# EAGLE design Mind-Synchronizing-Generator-Bak (EAGLE 7.2.0)
Analoger Wellenmustergenerator mit 3 (trippel-Fünf) 555 Timer.
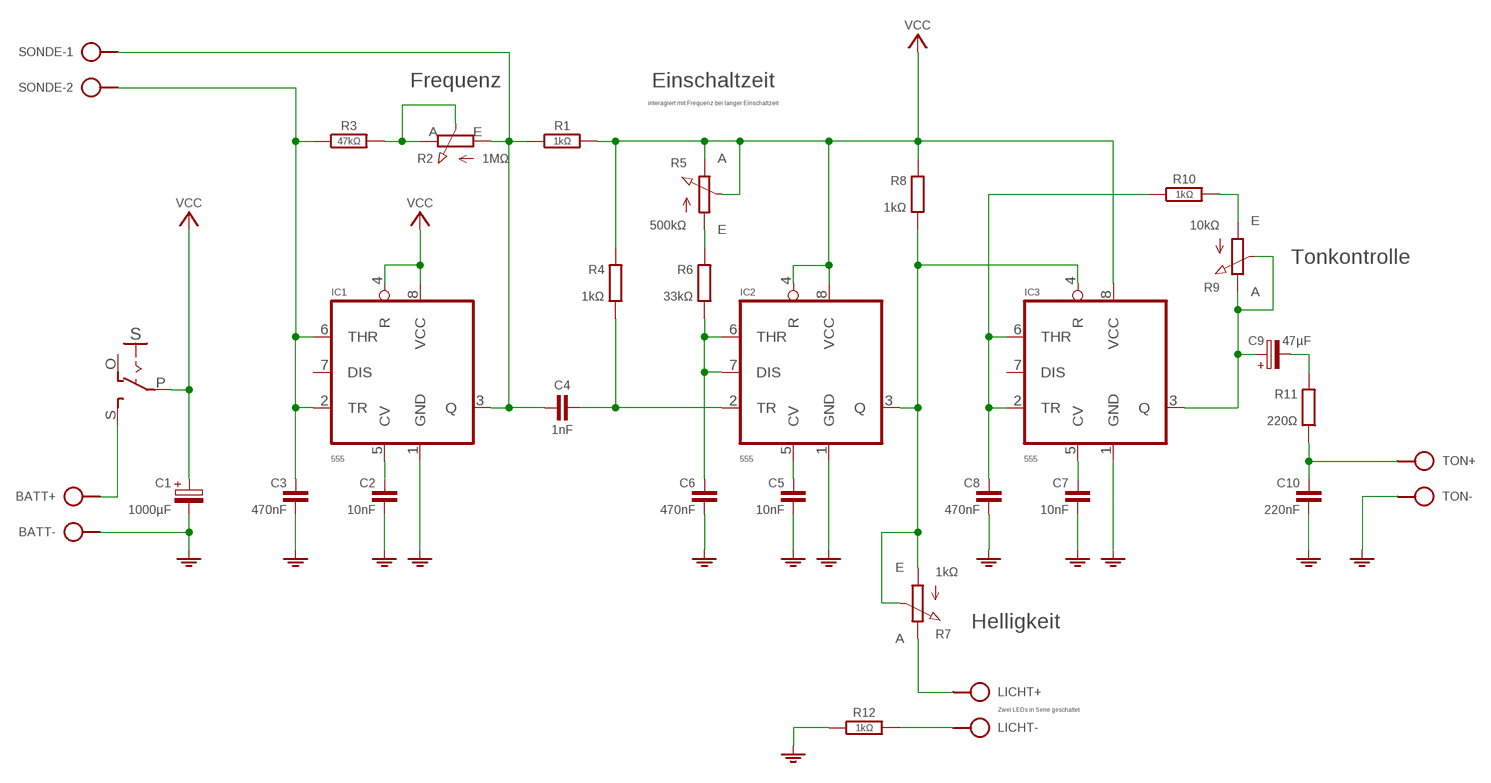
[diagram p0: schematic, sheet 1]

## Parts
BATT  SPAD+--+  [SPAD-+]
C1  1000µF  CPOLE2.5-6  [E2,5-6]
C2  10nF  C050-020X044  [C050-020X044]
C3  470nF  C050-040X075  [C050-040X075]
C4  1nF  C-H050-020X044  [C050-020X044]
C5  10nF  C050-020X044/V  [C050-020X044/V]
C6  470nF  C050-040X075  [C050-040X075]
C7  10nF  C075-020X044  [C075-020X044]
C8  470nF  C050-040X075  [C050-040X075]
C9  47µF  CPOL-HE2,5-4  [E2,5-4]
C10  220nF  C025-025X060  [C050-025X060]
IC1  555  555_ALT2-LBL  [555-DIL]
IC2  555  555_ALT2-LBL  [555-DIL]
IC3  555  555_ALT2-LBL  [555-DIL]
LICHT  SPAD+--+  [SPAD-+]
R1  1kΩ  R-H0204/10  [0204/10]
R2  1MΩ  POT-H-3P  [CONN-3P]
R3  47kΩ  R-H0204/10  [0204/10]
R4  1kΩ  R0204/10-V  [0204/10-V]
R5  500kΩ  POT-45X40  [POT-45X40]
R6  33kΩ  R0204/10  [0204/10]
R7  1kΩ  POT-3P  [CONN-3P]
R8  1kΩ  R0204/10-V  [0204/10-V]
R9  10kΩ  POT-45X40  [POT-45X40]
R10  1kΩ  R-H0204/10  [0204/10]
R11  220Ω  R0204/10-V  [0204/10-V]
R12  1kΩ  R-H0204/10  [0204/10]
S  SL-SW-1P-2T  [SLSW-1P2T]
SONDE  SPAD-2  [SPAD-2]
TON  SPAD+-+-  [SPAD+-]

## Nets
GND: BATT.1 C1.- C2.2 C3.2 C5.2 C6.2 C7.2 C8.2 C10.2 IC1.1(GND) IC2.1(GND) IC3.1(GND) R12.1 TON.1
N$1: C5.1 IC2.5(CV)
N$2: BATT.2 S.S
N$3: R2.2(S) R2.3(E) R3.2
N$4: LICHT.2 R7.3(E)
N$5: C4.2 IC2.2(TR) R4.2
N$6: C3.1 IC1.2(TR) IC1.6(THR) R3.1 SONDE.2
N$7: C2.1 IC1.5(CV)
N$8: R5.A R6.1
N$9: C6.1 IC2.6(THR) IC2.7(DIS) R6.2
N$10: R9.A R10.2
N$12: C8.1 IC3.2(TR) IC3.6(THR) R10.1
N$15: C9.- R11.1
N$16: C10.1 R11.2 TON.2
N$17: C7.1 IC3.5(CV)
N$18: LICHT.1 R12.2
Q1: C4.1 IC1.3(Q) R1.1 R2.1(A) SONDE.1
Q2: IC2.3(Q) IC3.4(R) R7.1(A) R7.2(S) R8.2
Q3: C9.+ IC3.3(Q) R9.E R9.S
VCC: C1.+ IC1.4(R) IC1.8(VCC) IC2.4(R) IC2.8(VCC) IC3.8(VCC) R1.2 R4.1 R5.E R5.S R8.1 S.P
Unconnected: IC1.7(DIS) IC3.7(DIS) S.O

## Notes on the sheet
- Frequenz | Einschaltzeit
- interagiert mit Frequenz bei langer Einschaltzeit
- Tonkontrolle
- Helligkeit
- Zwei LEDs in Serie geschaltet

## Library data of the parts
BATT LICHT TON = pad:SPAD+-
C1 = c:CPOL: POLARIZED CAPACITOR, European symbol
C2 C3 C5-C8 C10 = c:C: CAPACITOR, European symbol
C4 = c:C-H
C9 = c:CPOL-H
IC1-IC3 = ic:*555_ALT2
R1 R3 R10 R12 = r:R-H
R2 = r:POT-H
R4 R6 R8 R11 = r:R: RESISTOR, European symbol
R5 R7 R9 = r:POT
S = sw:SL-SW-1P-2T
SONDE = pad:SPAD-2

## Board
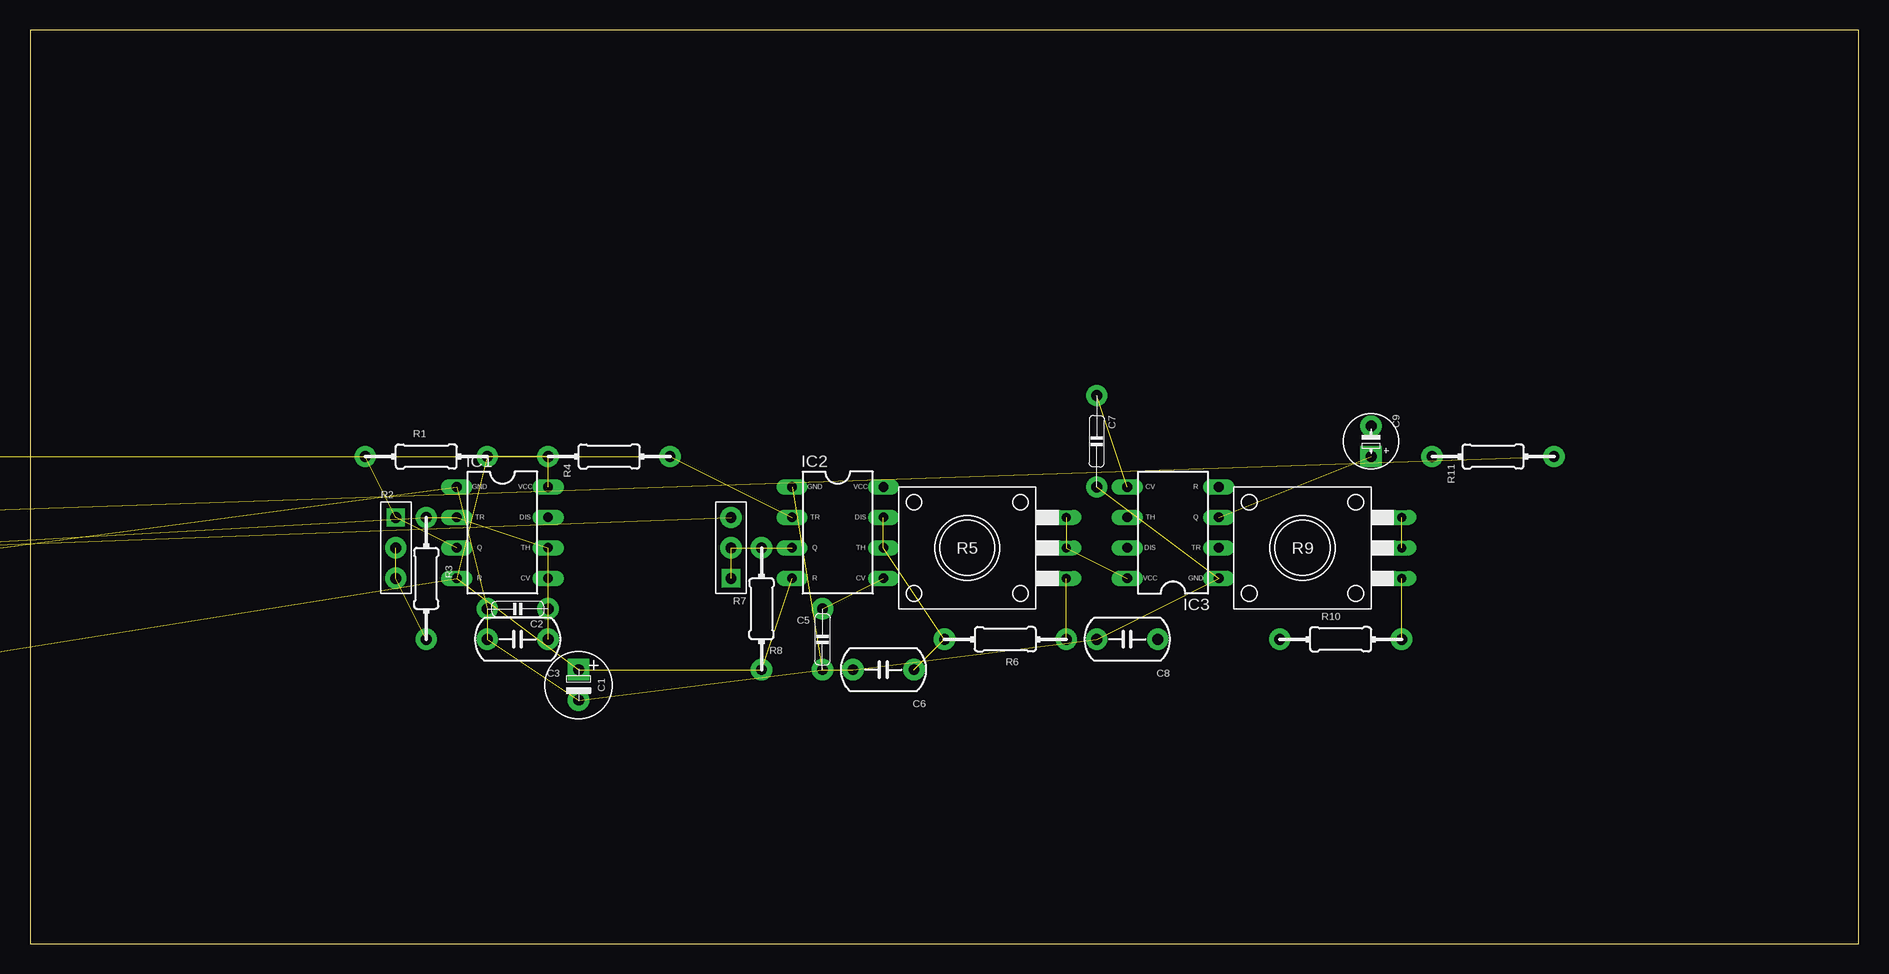
[diagram p1: board, top side]
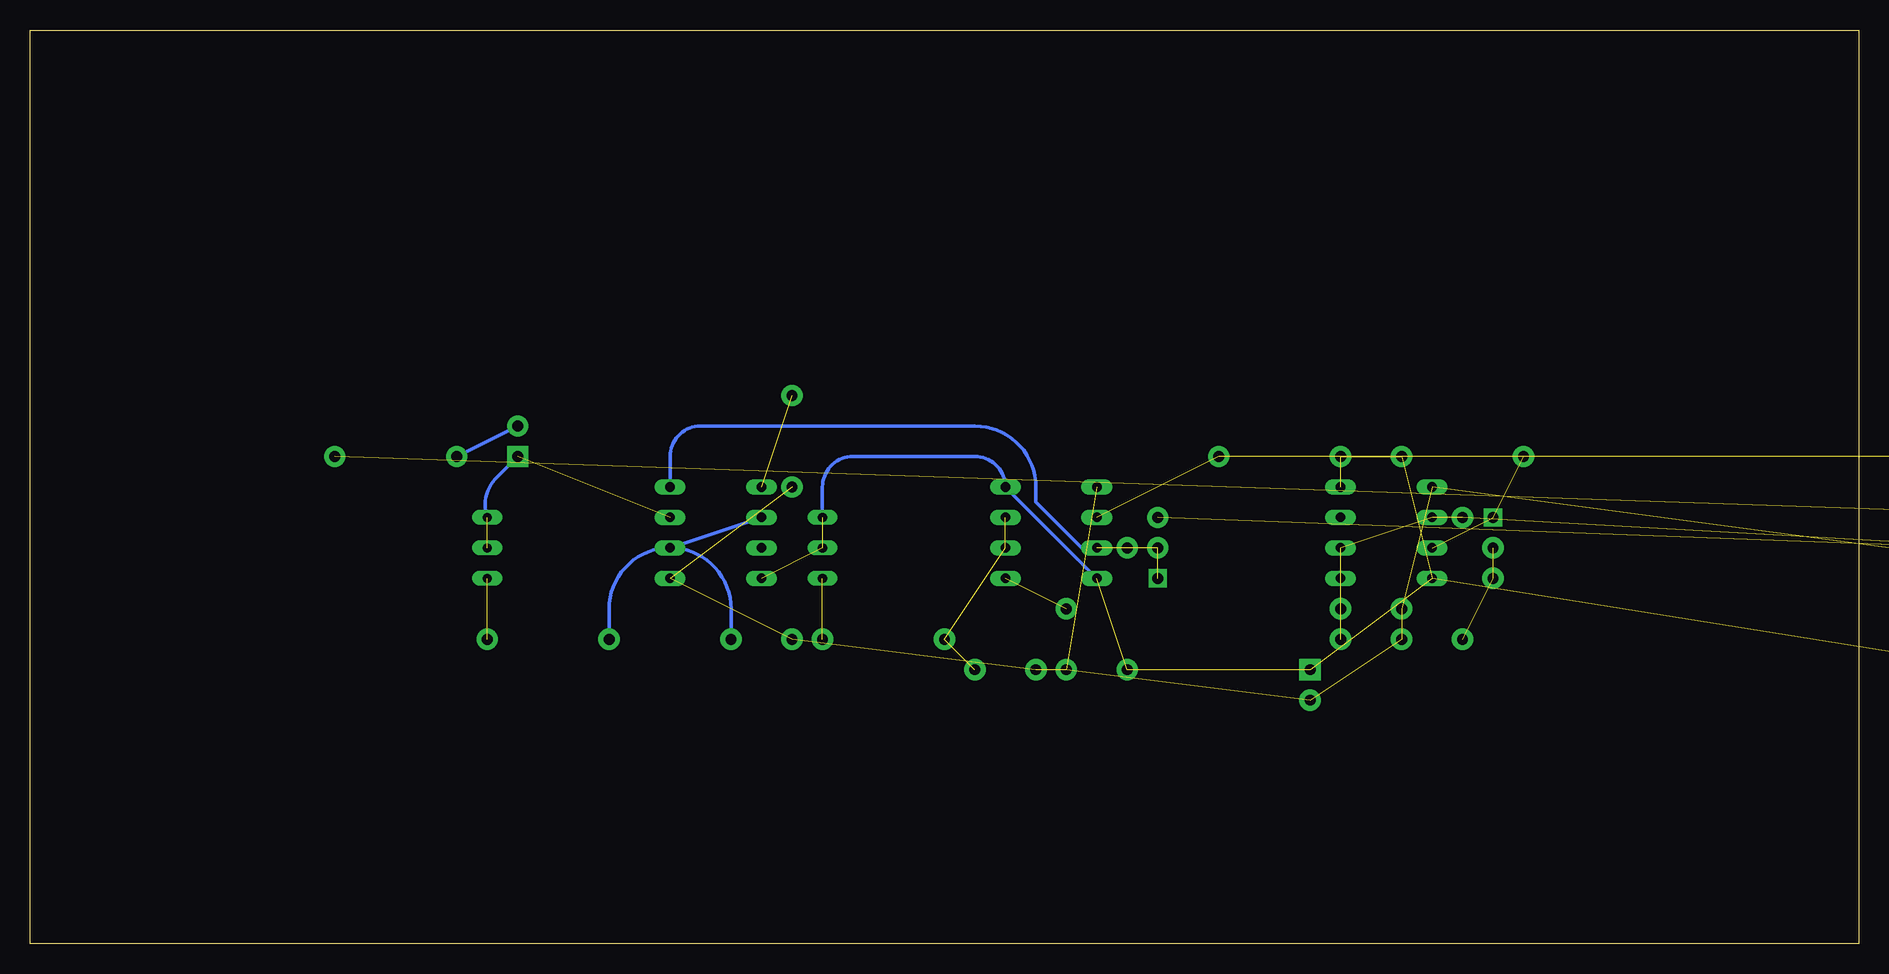
[diagram p2: board, bottom side, seen from below]

Size 152.4 x 76.2 mm. Coordinates in mm from the lower left corner, seen from the top.
Outline: 0,0 152.4,0 152.4,76.2 0,76.2 0,0
Copper layers (1*16): Top 0.035mm / dielectric 1.5mm / Bottom 0.035mm
Design rules "default": minimum track width 10mil, minimum drill 24mil, track to track 8mil, track to pad 8mil, pad to pad 8mil, via to via 8mil, smd to smd 8mil, copper to edge 40mil, drill to drill 8mil, minimum pad ring 10mil, minimum via ring 8mil, stop-mask expansion 4mil, vias tented up to drill 0mil, thermal gap 10mil

### Footprints (pad centres in the part's own frame; a part is rotated, then mirrored left to right if it is on the bottom)
SPAD-+ = drill 0.9 pad 1.524 square: 1 0,-1.27 | drill 0.9 pad 1.778: 2 0,1.27
E2,5-6 = drill 0.9 pad 1.778 square: + -1.27,0 | drill 0.9 pad 1.778: - 1.27,0
C050-020X044 = drill 0.9 pad 1.778: 1 -2.54,0; 2 2.54,0
C050-040X075 = drill 0.9 pad 1.778: 1 -2.54,0; 2 2.54,0
C050-020X044/V = drill 0.9 pad 1.778: 1 0,2.54; 2 0,-2.54
C075-020X044 = drill 0.9 pad 1.778: 1 -2.54,0; 2 5.08,0
E2,5-4 = drill 0.9 pad 1.778 square: + 1.27,0 | drill 0.9 pad 1.778: - -1.27,0
C050-025X060 = drill 0.9 pad 1.778: 1 0,2.54; 2 0,-2.54
555-DIL = drill 0.8 pad 1.27 long: 1 -3.81,3.81; 2 -3.81,1.27; 3 -3.81,-1.27; 4 -3.81,-3.81; 5 3.81,-3.81; 6 3.81,-1.27; 7 3.81,1.27; 8 3.81,3.81
0204/10 = drill 0.9 pad 1.778: 1 -5.08,0; 2 5.08,0
CONN-3P = drill 0.9 pad 1.524 square: 1 0,2.54 | drill 0.9 pad 1.778: 2 0,0; 3 0,-2.54
0204/10-V = drill 0.9 pad 1.778: 1 0,5.08; 2 0,-5.08
POT-45X40 = drill 0.762 long: A 0,-2.54; E 0,2.54; S 0,0
SLSW-1P2T = drill 1.1 pad 1.778 octagon: O 0,2.54; P 0,0; S 0,-2.54
SPAD-2 = drill 0.9 pad 1.778: 1 0,-1.27; 2 0,1.27
SPAD+- = drill 0.9 pad 1.524 square: 1 0,-1.27 | drill 0.9 pad 1.778: 2 0,1.27

### Placement (x,y rotation side)
BATT  -39.37,30.48 0 top  (outside the outline)
C1  45.72,21.59 270 top
C2  40.64,27.94 180 top
C3  40.64,25.4 180 top
C4  -21.59,40.64 0 top  (outside the outline)
C5  66.04,25.4 0 top
C6  71.12,22.86 180 top
C7  88.9,43.18 270 top
C8  91.44,25.4 180 top
C9  111.76,41.91 270 top
C10  -21.59,33.02 0 top  (outside the outline)
IC1  39.37,34.29 0 top
IC2  67.31,34.29 0 top
IC3  95.25,34.29 180 top
LICHT  -43.18,30.48 0 top  (outside the outline)
R1  33.02,40.64 0 top
R2  30.48,33.02 0 top
R3  33.02,30.48 270 top
R4  48.26,40.64 90 top
R5  86.36,33.02 0 top
R6  81.28,25.4 180 top
R7  58.42,33.02 180 top
R8  60.96,27.94 180 top
R9  114.3,33.02 0 top
R10  109.22,25.4 0 top
R11  121.92,40.64 90 top
R12  -19.05,48.26 0 top  (outside the outline)
S  -27.94,20.32 0 top  (outside the outline)
SONDE  -34.29,30.48 0 top  (outside the outline)
TON  -48.26,30.48 0 top  (outside the outline)

### Tracks (layer width: path | path; a pad name or v marks a point on that pad's centre or on a via)
GND  (13 unrouted)
N$1  (1 unrouted)
N$2  (1 unrouted)
N$3  (2 unrouted)
N$4  (1 unrouted)
N$5  (2 unrouted)
N$6  (4 unrouted)
N$7  (1 unrouted)
N$8  (1 unrouted)
N$9  (3 unrouted)
N$10  (1 unrouted)
N$12
  Bottom 0.305: R10.1 104.14,27.94 arc90 IC3.2 | IC3.2 IC3.6 | IC3.2 arc90 93.98,27.94 C8.1
N$15
  Bottom 0.305: R11.1 C9.-
N$16  (2 unrouted)
N$17  (1 unrouted)
N$18  (1 unrouted)
Q1  (4 unrouted)
Q2  (3 unrouted)
  Bottom 0.305: IC3.4 99.06,40.64 arc90 96.52,43.18 73.66,43.18 arc90 68.58,38.1 68.58,36.83 64.77,33.02 IC2.3
Q3  (2 unrouted)
  Bottom 0.305: C9.+ 113.67,38.73 arc-60 R9.E
VCC  (9 unrouted)
  Bottom 0.305: R5.E 86.36,38.1 arc90 83.82,40.64 73.66,40.64 arc90 IC2.8 IC2.4